# Altium schematic sheet MCU.SchDoc
size A4; SheetNumber: 3; SheetTotal: 8
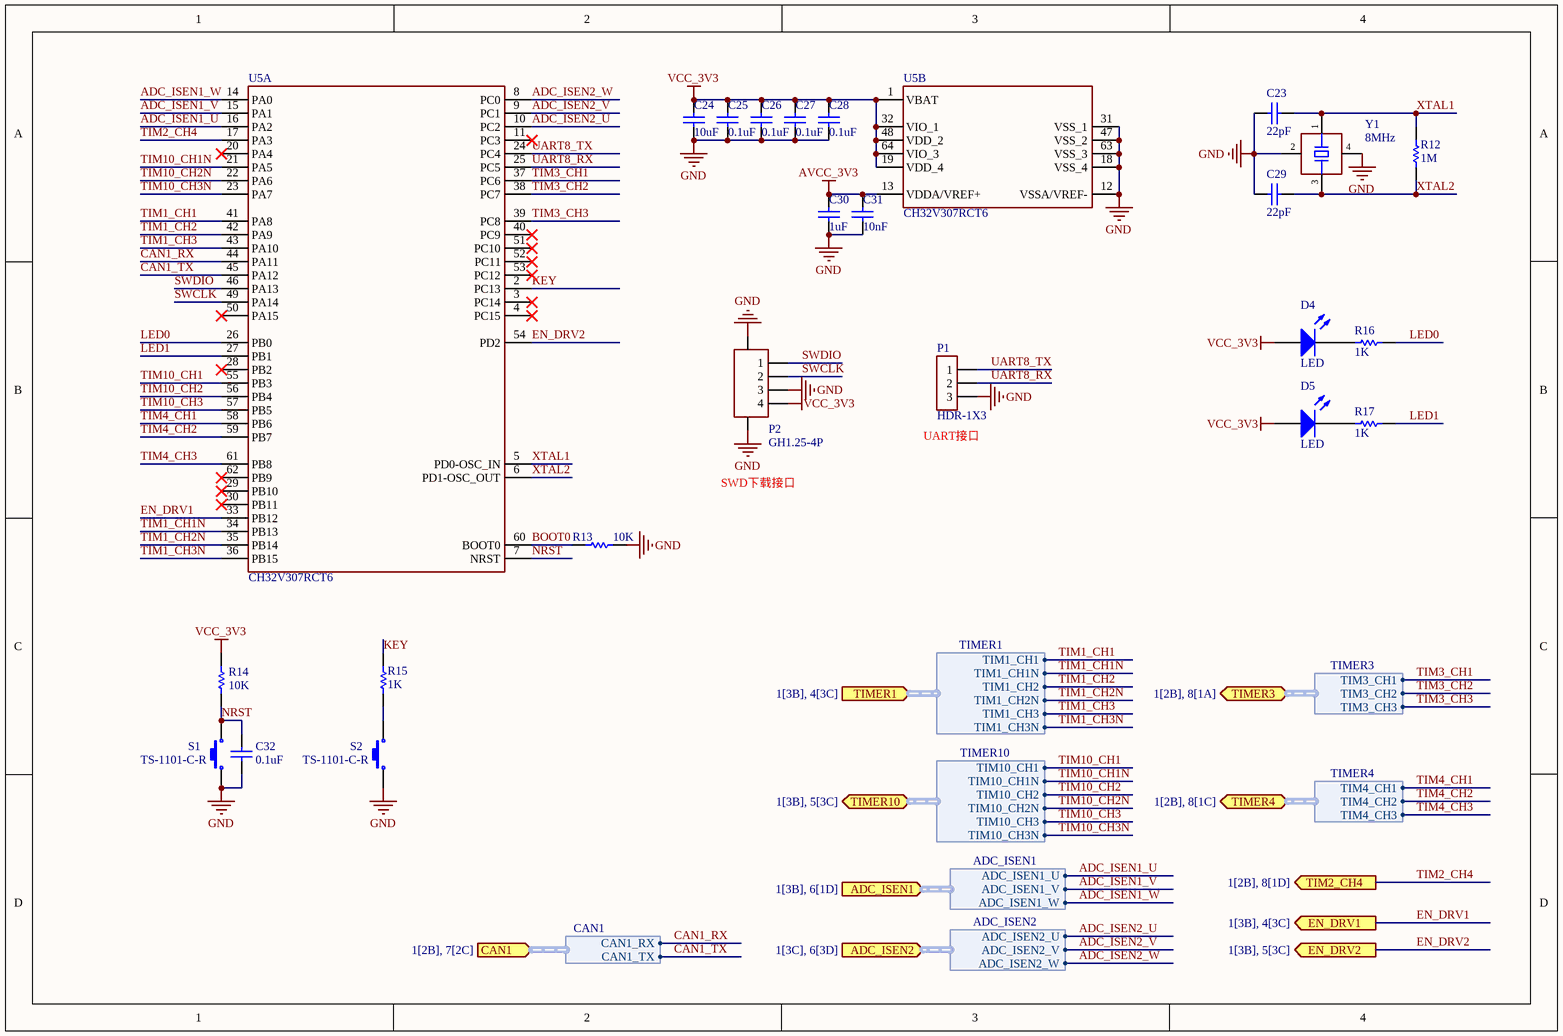
[diagram p0: MCU.SchDoc]

## Parts
C23  22pF  [C0603_NS]
C24  10uF  [C0603_NS]
C25  0.1uF  [C0603_NS]
C26  0.1uF  [C0603_NS]
C27  0.1uF  [C0603_NS]
C28  0.1uF  [C0603_NS]
C29  22pF  [C0603_NS]
C30  1uF  [C0603_NS]
C31  10nF  [C0603_NS]
C32  0.1uF  [C0603_NS]
D4  LED  [LED0603_NS]
D5  LED  [LED0603_NS]
P1  HDR-1X3  [HDR2.54-WI-3P]
P2  GH1.25-4P  [A1257WR-S-4P]
R12  1M  [R0603_NS]
R13  10K  [R0603_NS]
R14  10K  [R0603_NS]
R15  1K  [R0603_NS]
R16  1K  [R0603_NS]
R17  1K  [R0603_NS]
S1  TS-1101-C-R  [TS-1101]
S2  TS-1101-C-R  [TS-1101]
U5  CH32V307RCT6  [LQFP64_N]  (parts A,B of 2)
Y1  8MHz  [SMD-3225-4P]

## Ports
ADC_ISEN1 (in, harness ADC_ISEN1, see 1[3B], 6[1D]), ADC_ISEN2 (in, harness ADC_ISEN2, see 1[3C], 6[3D]), CAN1 (in, harness CAN1, see 1[2B], 7[2C]), EN_DRV1 (out, see 1[3B], 4[3C]), EN_DRV2 (out, see 1[3B], 5[3C]), TIM2_CH4 (out, see 1[2B], 8[1D]), TIMER1 (in, harness TIMER1, see 1[3B], 4[3C]), TIMER3 (bidir, harness TIMER3, see 1[2B], 8[1A]), TIMER4 (bidir, harness TIMER4, see 1[2B], 8[1C]), TIMER10 (bidir, harness TIMER10, see 1[3B], 5[3C])

## Harnesses
TIMER1: TIM1_CH1, TIM1_CH2, TIM1_CH3, TIM1_CH1N, TIM1_CH2N, TIM1_CH3N
TIMER10: TIM10_CH1N, TIM10_CH2N, TIM10_CH3N, TIM10_CH1, TIM10_CH2, TIM10_CH3
TIMER4: TIM4_CH1, TIM4_CH2, TIM4_CH3
TIMER3: TIM3_CH1, TIM3_CH2, TIM3_CH3
CAN1: CAN1_RX, CAN1_TX
ADC_ISEN1: ADC_ISEN1_W, ADC_ISEN1_V, ADC_ISEN1_U
ADC_ISEN2: ADC_ISEN2_W, ADC_ISEN2_V, ADC_ISEN2_U

## Nets
AVCC_3V3: C30.2 C31.2 U5.13(VDDA/VREF+)
GND: C23.1 C24.1 C25.1 C26.1 C27.1 C28.1 C29.1 C30.1 C31.1 C32.1 P1.3 P2.0 P2.3 R13.2 S1.1 S2.1 U5.12(VSSA/VREF-) U5.18(VSS_4) U5.31(VSS_1) U5.47(VSS_2) U5.63(VSS_3) Y1.2 Y1.4
VCC_3V3: C24.2 C25.2 C26.2 C27.2 C28.2 D4.1(A) D5.1(A) P2.4 R14.1 U5.1(VBAT) U5.19(VDD_4) U5.32(VIO_1) U5.48(VDD_2) U5.64(VIO_3)
ADC_ISEN1_U: U5.16(PA2) ; port ADC_ISEN1.ADC_ISEN1_U
ADC_ISEN1_V: U5.15(PA1) ; port ADC_ISEN1.ADC_ISEN1_V
ADC_ISEN1_W: U5.14(PA0) ; port ADC_ISEN1.ADC_ISEN1_W
ADC_ISEN2_U: U5.10(PC2) ; port ADC_ISEN2.ADC_ISEN2_U
ADC_ISEN2_V: U5.9(PC1) ; port ADC_ISEN2.ADC_ISEN2_V
ADC_ISEN2_W: U5.8(PC0) ; port ADC_ISEN2.ADC_ISEN2_W
BOOT0: R13.1 U5.60(BOOT0)
CAN1_RX: U5.44(PA11) ; port CAN1.CAN1_RX
CAN1_TX: U5.45(PA12) ; port CAN1.CAN1_TX
EN_DRV1: U5.33(PB12) ; port EN_DRV1
EN_DRV2: U5.54(PD2) ; port EN_DRV2
KEY: R15.2 U5.2(PC13)
LED0: R16.2 U5.26(PB0)
LED1: R17.2 U5.27(PB1)
NRST: C32.2 R14.2 S1.2 U5.7(NRST)
SWCLK: P2.2 U5.49(PA14)
SWDIO: P2.1 U5.46(PA13)
TIM1_CH1: U5.41(PA8) ; port TIMER1.TIM1_CH1
TIM1_CH1N: U5.34(PB13) ; port TIMER1.TIM1_CH1N
TIM1_CH2: U5.42(PA9) ; port TIMER1.TIM1_CH2
TIM1_CH2N: U5.35(PB14) ; port TIMER1.TIM1_CH2N
TIM1_CH3: U5.43(PA10) ; port TIMER1.TIM1_CH3
TIM1_CH3N: U5.36(PB15) ; port TIMER1.TIM1_CH3N
TIM2_CH4: U5.17(PA3) ; port TIM2_CH4
TIM3_CH1: U5.37(PC6) ; port TIMER3.TIM3_CH1
TIM3_CH2: U5.38(PC7) ; port TIMER3.TIM3_CH2
TIM3_CH3: U5.39(PC8) ; port TIMER3.TIM3_CH3
TIM4_CH1: U5.58(PB6) ; port TIMER4.TIM4_CH1
TIM4_CH2: U5.59(PB7) ; port TIMER4.TIM4_CH2
TIM4_CH3: U5.61(PB8) ; port TIMER4.TIM4_CH3
TIM10_CH1: U5.55(PB3) ; port TIMER10.TIM10_CH1
TIM10_CH1N: U5.21(PA5) ; port TIMER10.TIM10_CH1N
TIM10_CH2: U5.56(PB4) ; port TIMER10.TIM10_CH2
TIM10_CH2N: U5.22(PA6) ; port TIMER10.TIM10_CH2N
TIM10_CH3: U5.57(PB5) ; port TIMER10.TIM10_CH3
TIM10_CH3N: U5.23(PA7) ; port TIMER10.TIM10_CH3N
UART8_RX: P1.2 U5.25(PC5)
UART8_TX: P1.1 U5.24(PC4)
XTAL1: C23.2 R12.2 U5.5(PD0-OSC_IN) Y1.1
XTAL2: C29.2 R12.1 U5.6(PD1-OSC_OUT) Y1.3
NetD4_2: D4.2(K) R16.1
NetD5_2: D5.2(K) R17.1
NetR15_1: R15.1 S2.2

Not connected (* = marked no-connect by the designer): U5 3(PC14)* 4(PC15)* 11(PC3)* 20(PA4)* 28(PB2)* 29(PB10)* 30(PB11)* 40(PC9)* 50(PA15)* 51(PC10)* 52(PC11)* 53(PC12)* 62(PB9)*

## Notes on the sheet
- (near P1) UART接口
- SWD下载接口

## Library data of the parts
C23-C32 = Cap: Capacitor
  C23 C29: Published: 8-Jun-2000; LatestRevisionDate: 17-Jul-2002; LatestRevisionNote: Re-released for DXP Platform.; PackageReference: RAD-0.3; Publisher: Altium Limited; PackageDescription: Radial Cap, Thru-Hole; 2 Leads; 0.3 in Pin Spacing; Value: 22pF
D4 D5 = LED0: Typical INFRARED GaAs LED
P2 = Header4
R12-R17 = Res1: Resistor
S1 S2 = SW
Y1 = XTAL